# Altium project cybd18SV1.2.3F.PrjPcb
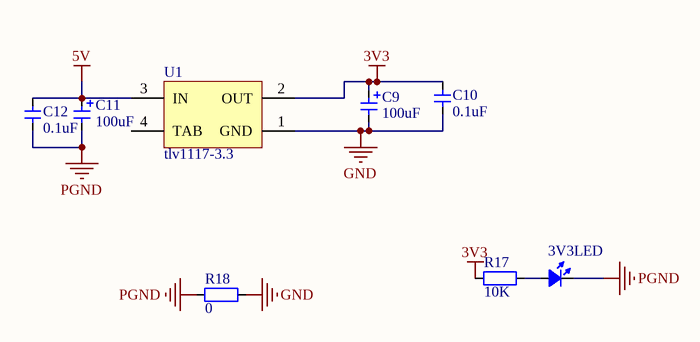
[diagram p0: tlv117_5_3.3.SchDoc]
9 sheets, 74 parts. Net scope: global (net labels, ports and power ports of the same name join across sheets).
Board file: cybd18SV1.2.3F.PcbDoc
Sheets:
  tlv117_5_3.3.SchDoc
  taj1050.SchDoc
  lm27313_5_12.SchDoc
  HIP4082driver.SchDoc
  tps5430_VIN_5V.SchDoc
  电流环.SchDoc
  74ls08.SchDoc
  F103H.SchDoc
  hcpl0630.SchDoc

## Sheet tlv117_5_3.3.SchDoc
size A4

### Parts
3V3LED  LED_0805  [LED_0805_BLUE]  (value not drawn)
C9  value 100uF  [CAP-TAN-6032/CAPC]  (hidden comment: Cap_Tan_0805)
C10  value 0.1uF  [CAP_0603]  (hidden comment: Cap_0603)
C11  value 100uF  [CAP-TAN-6032/CAPC]  (hidden comment: Cap_Tan_0805)
C12  value 0.1uF  [CAP_0603]  (hidden comment: Cap_0603)
R17  value 10K  [RES_0603]  (hidden comment: Res_0603)
R18  value 0  [RES_0603]  (hidden comment: Res_0603)
U1  tlv1117-3.3  [SOT223-3]

### Nets
3V3: C9.1 C10.2 R17.1 U1.2(OUT)
5V: C11.1 C12.2 U1.3(IN)
GND: C9.2 C10.1 R18.2 U1.1(GND)
PGND: 3V3LED.2(K) C11.2 C12.1 R18.1
Net3V3LED_1: 3V3LED.1(A) R17.2

Not connected (* = marked no-connect by the designer): U1 4(TAB)

### Library data of the parts
3V3LED = LED_0603: LED
C9 C11 = Cap_Tan_0805: Capacitor
C10 C12 = Cap_0603: Capacitor
R17 R18 = Res_0603: Resistor
U1 = LM1117IMP-5.0: 800mA Low-Dropout Linear Regulator; Manufacturer: National Semiconductor; CompType: LDO IC; PackageTopMarking: XYTT*N06B; PowerWise: N; Published: 4-Dec-2008; DatasheetVersion: Apr-2006; PackageVersion: revB, Apr-2003; PackageReference: MP04A; Publisher: Altium Limited; PackageDescription: Molded SOT-223, 6.50 x 3.56 x 1.6mm Body, 4 Lead, 2.3mm Pitch; PartNumber: LM1117IMP-5.0; RoHS: O; PinCount: 4; DigiKeyPartNumber: LM1117IMP-5.0CT-ND; Code_JEDEC: TO-261-AA; Code_IPC: SOT223-4; ComponentLink1Description: LM1117 Datasheet; ComponentLink1URL: http://www.national.com/ds/LM/LM1117.pdf; ComponentLink2Description: LM1117 Web Page; ComponentLink2URL: http://www.national.com/pf/LM/LM1117.html; ComponentLink3Description: MP04A Package Page; ComponentLink3URL: http://www.national.com/packaging/folders/mp04a.html

## Sheet taj1050.SchDoc
size A4
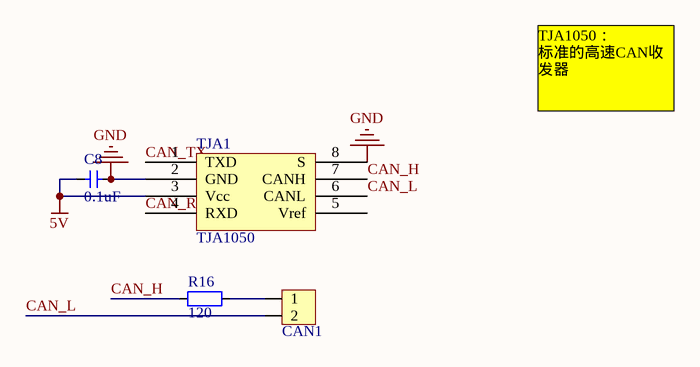
[diagram p1: taj1050.SchDoc]

### Parts
C8  value 0.1uF  [CAP_0603]  (hidden comment: Cap_0603)
CAN1  HDR1x2_2.54  [HDR1X2_2.54_180]  (value not drawn)
R16  value 120  [RES_0603]  (hidden comment: Res_0603)
TJA1  TJA1050  [SOP_E150_8]

### Nets
5V: C8.1 TJA1.3(Vcc)
GND: C8.2 TJA1.2(GND) TJA1.8(S)
CAN_H: R16.1 TJA1.7(CANH)
CAN_L: CAN1.2 TJA1.6(CANL)
CAN_RX: TJA1.4(RXD)
CAN_TX: TJA1.1(TXD)
NetCAN1_1: CAN1.1 R16.2

Not connected (* = marked no-connect by the designer): TJA1 5(Vref)

### Notes on the sheet
- TJA1050：
  标准的高速CAN收发器

### Library data of the parts
C8 = Cap_0603: Capacitor
CAN1 = HDR1x2_2.54: Header
R16 = Res_0603: Resistor
TJA1 = TJA1050: CAN总线收发器

## Sheet lm27313_5_12.SchDoc
size A4
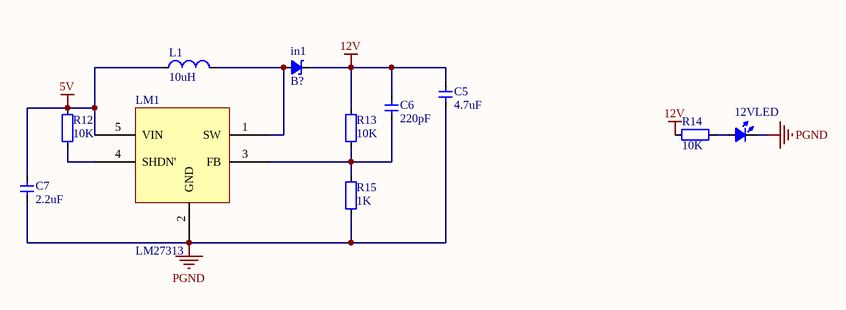
[diagram p2: lm27313_5_12.SchDoc]

### Parts
12VLED  LED_0805  [LED_0805_GREEN]  (value not drawn)
C5  value 4.7uF  [CAP_0603]  (hidden comment: Cap_0603)
C6  value 220pF  [CAP_0603]  (hidden comment: Cap_0603)
C7  value 2.2uF  [CAP_0603]  (hidden comment: Cap_0603)
in1  value B?  [SOD-123]  (hidden comment: SchottkyDiode_SOD123)
L1  value 10uH  [indmm5x2_2_2]
LM1  LM27313  [SOT23-5]
R12  value 10K  [RES_0603]  (hidden comment: Res_0603)
R13  value 10K  [RES_0603]  (hidden comment: Res_0603)
R14  value 10K  [RES_0603]  (hidden comment: Res_0603)
R15  value 1K  [RES_0603]  (hidden comment: Res_0603)

### Nets
5V: C7.2 L1.1 LM1.5(VIN) R12.2
12V: C5.2 C6.2 in1.2(K) R13.2 R14.1
PGND: 12VLED.2(K) C5.1 C7.1 LM1.2(GND) R15.1
Net12VLED_1: 12VLED.1(A) R14.2
NetC6_1: C6.1 LM1.3(FB) R13.1 R15.2
Netin1_1: in1.1(A) L1.2 LM1.1(SW)
NetLM1_4: LM1.4(SHDN') R12.1

### Library data of the parts
12VLED = LED_0603: LED
C5-C7 = Cap_0603: Capacitor
in1 = SchottkyDiode_SOD123: Diode
L1 = Ind_0603: Inductor
R12-R15 = Res_0603: Resistor

## Sheet HIP4082driver.SchDoc
size A4
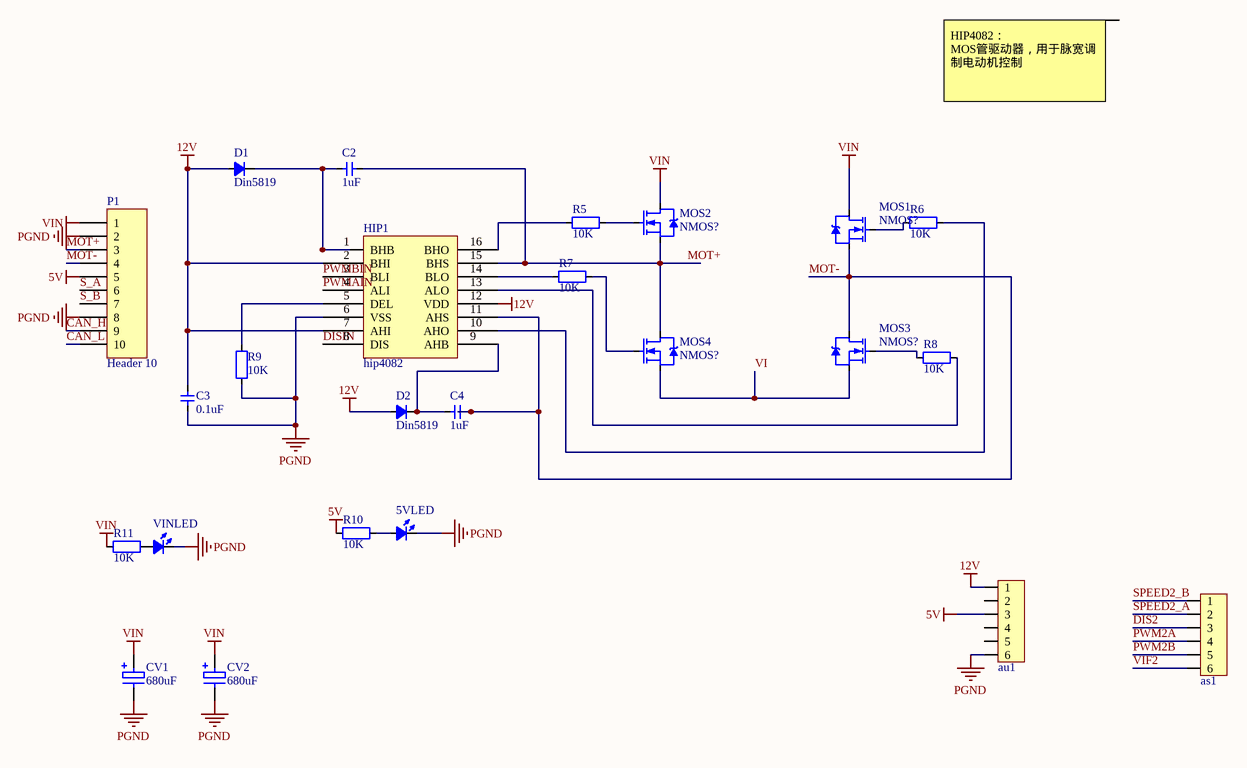
[diagram p3: HIP4082driver.SchDoc]

### Parts
5VLED  LED_0805  [LED_0805_BLUE]  (value not drawn)
as1  HDR1x6_2.54  [HDR1X6_2.54_180]  (value not drawn)
au1  HDR1x6_2.54  [HDR1X6_2.54_180]  (value not drawn)
C2  value 1uF  [CAP_0603]  (hidden comment: Cap_0603)
C3  value 0.1uF  [CAP_0603]  (hidden comment: Cap_0603)
C4  value 1uF  [CAP_0603]  (hidden comment: Cap_0603)
CV1  680uF  [CAP_ELE_680UF0.7X5MM]
CV2  680uF  [CAP_ELE_680UF0.7X5MM]
D1  Din5819  [SOD-323]
D2  Din5819  [SOD-323]
HIP1  hip4082  [SOP_E150_16]
MOS1  value NMOS?  [TO-252AA]  (hidden comment: MOSFET_N)
MOS2  value NMOS?  [TO-252AA]  (hidden comment: MOSFET_N)
MOS3  value NMOS?  [TO-252AA]  (hidden comment: MOSFET_N)
MOS4  value NMOS?  [TO-252AA]  (hidden comment: MOSFET_N)
P1  Header 10  [Green_10P]
R5  value 10K  [RES_0603]  (hidden comment: Res_0603)
R6  value 10K  [RES_0603]  (hidden comment: Res_0603)
R7  value 10K  [RES_0603]  (hidden comment: Res_0603)
R8  value 10K  [RES_0603]  (hidden comment: Res_0603)
R9  value 10K  [RES_0603]  (hidden comment: Res_0603)
R10  value 10K  [RES_0603]  (hidden comment: Res_0603)
R11  value 10K  [RES_0603]  (hidden comment: Res_0603)
VINLED  LED_0805  [LED_0805_RED]  (value not drawn)

### Nets
5V: au1.3 P1.5 R10.1
12V: au1.1 C3.2 D1.1(A) D2.1(A) HIP1.2(BHI) HIP1.7(AHI) HIP1.12(VDD)
PGND: 5VLED.2(K) au1.6 C3.1 CV1.2 CV2.2 HIP1.6(VSS) P1.2 P1.8 R9.1 VINLED.2(K)
VIN: CV1.1 CV2.1 MOS1.4(D) MOS2.4(D) P1.1 R11.1
CAN_H: P1.9
CAN_L: P1.10
DIS2: as1.3
DISIN: HIP1.8(DIS)
MOT+: C2.2 HIP1.15(BHS) MOS2.3(S) MOS4.4(D) P1.3
MOT-: C4.2 HIP1.11(AHS) MOS1.3(S) MOS3.4(D) P1.4
PWM2A: as1.4
PWM2B: as1.5
PWMAIN: HIP1.4(ALI)
PWMBIN: HIP1.3(BLI)
S_A: P1.6
S_B: P1.7
SPEED2_A: as1.2
SPEED2_B: as1.1
VI: MOS3.3(S) MOS4.3(S)
VIF2: as1.6
Net5VLED_1: 5VLED.1(A) R10.2
NetC2_1: C2.1 D1.2(K) HIP1.1(BHB)
NetC4_1: C4.1 D2.2(K) HIP1.9(AHB)
NetHIP1_5: HIP1.5(DEL) R9.2
NetHIP1_10: HIP1.10(AHO) R6.2
NetHIP1_13: HIP1.13(ALO) R8.2
NetHIP1_14: HIP1.14(BLO) R7.1
NetHIP1_16: HIP1.16(BHO) R5.1
NetMOS1_1: MOS1.1(G) R6.1
NetMOS2_1: MOS2.1(G) R5.2
NetMOS3_1: MOS3.1(G) R8.1
NetMOS4_1: MOS4.1(G) R7.2
NetR11_2: R11.2 VINLED.1(A)

Not connected (* = marked no-connect by the designer): au1 2 4 5

### Notes on the sheet
- HIP4082：
  MOS管驱动器，用于脉宽调制电动机控制

### Library data of the parts
5VLED VINLED = LED_0603: LED
as1 au1 = HDR1x6_2.54: Header
C2-C4 = Cap_0603: Capacitor
CV1 CV2 = CAP-ELE: 电解电容; Value: *μF; Published: 8-Jun-2000; LatestRevisionDate: 17-Jul-2002; LatestRevisionNote: Re-released for DXP Platform.; PackageReference: RB7.6-15; Publisher: Altium Limited; PackageDescription: Polarized Capacitor (Radial); 2 Leads
D1 D2 = Diode
MOS1-MOS4 = MOSFET_N: MOSFET
P1 = Header 10: Header, 10-Pin; LatestRevisionDate: 17-Jul-2002; LatestRevisionNote: Re-released for DXP Platform.; Publisher: Altium Limited
R5-R11 = Res_0603: Resistor

## Sheet tps5430_VIN_5V.SchDoc
size A4
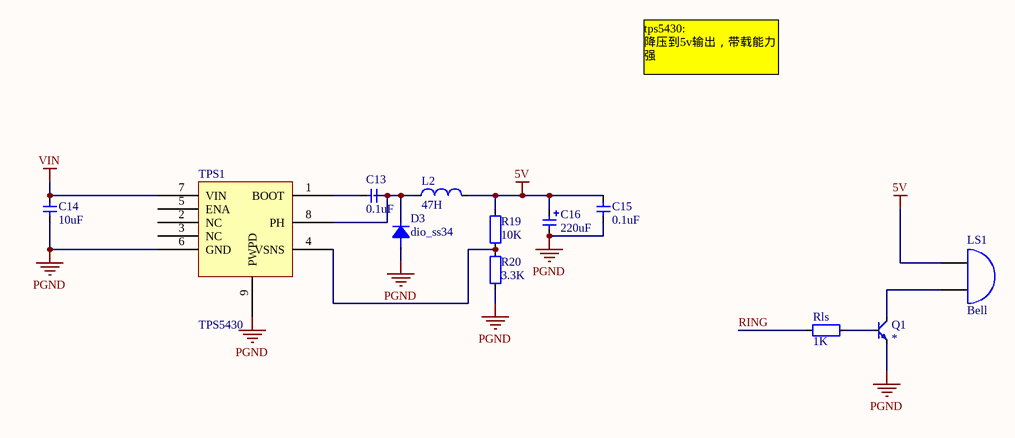
[diagram p4: tps5430_VIN_5V.SchDoc]

### Parts
(Parts that share a designator on the sheet are numbered #1, #2 ... from top to bottom, then left to right.)
C13  value 0.1uF  [CAP_0603]  (hidden comment: Cap_0603)
C14  value 10uF  [CAP_0603]  (hidden comment: Cap_0603)
C15  value 0.1uF  [CAP_0603]  (hidden comment: Cap_0603)
C16  value 220uF  [CAP-TAN-7343/CAPD]  (hidden comment: Cap_Tan_0805)
D3  dio_ss34  [dio_ss34]
L2  value 47H  [indmm5x1.2x4x5]  (hidden comment: Ind_0603)
LS1#1  Bell  [Bell-5.6-0.6-9mm]
Q1  BJT_NPN  [SOT23-3]  (value not drawn)
R19  value 10K  [RES_0603]  (hidden comment: Res_0603)
R20  value 3.3K  [RES_0603]  (hidden comment: Res_0603)
Rls  value 1K  [RES_0603]  (hidden comment: Res_0603)
TPS1  TPS5430  [SOP_E150_9]

### Nets
5V: C15.2 C16.1 L2.2 LS1#1.1(A) R19.2
PGND: C14.1 C15.1 C16.2 D3.1 Q1.2(E) R20.1 TPS1.6(GND) TPS1.9(PWPD)
VIN: C14.2 TPS1.7(VIN)
RING: Rls.1
NetC13_1: C13.1 TPS1.1(BOOT)
NetC13_2: C13.2 D3.2 L2.1 TPS1.8(PH)
NetLS1#1_2: LS1#1.2(B) Q1.3(C)
NetQ1_1: Q1.1(B) Rls.2
NetR19_1: R19.1 R20.2 TPS1.4(VSNS)

Not connected (* = marked no-connect by the designer): TPS1 2(NC) 3(NC) 5(ENA)

### Notes on the sheet
- tps5430:
  降压到5v输出，带载能力强

### Library data of the parts
C13-C15 = Cap_0603: Capacitor
C16 = Cap_Tan_0805: Capacitor
L2 = Ind_0603: Inductor
LS1#1 = Bell: Electrical Bell; Published: 24-Mar-1999; LatestRevisionDate: 17-Jul-2002; LatestRevisionNote: Re-released for DXP Platform.; PackageReference: PIN2; Publisher: Altium Limited
Q1 = BJT_NPN: Transistor; Value: *
R19 R20 Rls = Res_0603: Resistor

## Sheet 电流环.SchDoc
size A4
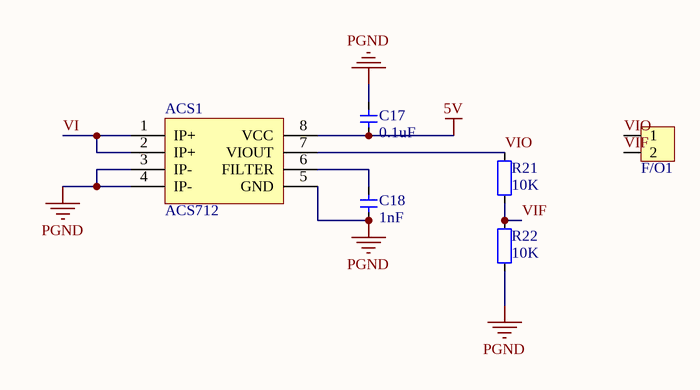
[diagram p5: 电流环.SchDoc]

### Parts
ACS1  ACS712  [SOP8ACS712]
C17  value 0.1uF  [CAP_0603]  (hidden comment: Cap_0603)
C18  value 1nF  [CAP_0603]  (hidden comment: Cap_0603)
F/O1  HDR1x2_2.54  [HDR1X2_2.54_180]  (value not drawn)
R21  value 10K  [RES_0603]  (hidden comment: Res_0603)
R22  value 10K  [RES_0603]  (hidden comment: Res_0603)

### Nets
5V: ACS1.8(VCC) C17.1
PGND: ACS1.3(IP-) ACS1.4(IP-) ACS1.5(GND) C17.2 C18.1 R22.2
VI: ACS1.1(IP+) ACS1.2(IP+)
VIF: F/O1.2 R21.2 R22.1
VIO: ACS1.7(VIOUT) F/O1.1 R21.1
NetACS1_6: ACS1.6(FILTER) C18.2

### Library data of the parts
ACS1 = ACS712: Sensor Current
C17 C18 = Cap_0603: Capacitor
F/O1 = HDR1x2_2.54: Header
R21 R22 = Res_0603: Resistor

## Sheet 74ls08.SchDoc
size A4
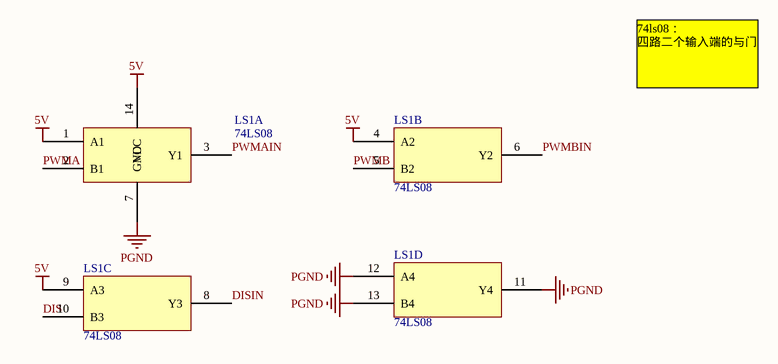
[diagram p6: 74ls08.SchDoc]

### Parts
(Parts that share a designator on the sheet are numbered #1, #2 ... from top to bottom, then left to right.)
LS1#2  74LS08  [SOP14]  (parts A,B,C,D of 4)

### Nets
5V: LS1#2.1(A1) LS1#2.4(A2) LS1#2.9(A3) LS1#2.14(VCC)
PGND: LS1#2.7(GND) LS1#2.11(Y4) LS1#2.12(A4) LS1#2.13(B4)
DIS: LS1#2.10(B3)
DISIN: LS1#2.8(Y3)
PWMA: LS1#2.2(B1)
PWMAIN: LS1#2.3(Y1)
PWMB: LS1#2.5(B2)
PWMBIN: LS1#2.6(Y2)

### Notes on the sheet
- 74ls08：
  四路二个输入端的与门

## Sheet F103H.SchDoc
size A4
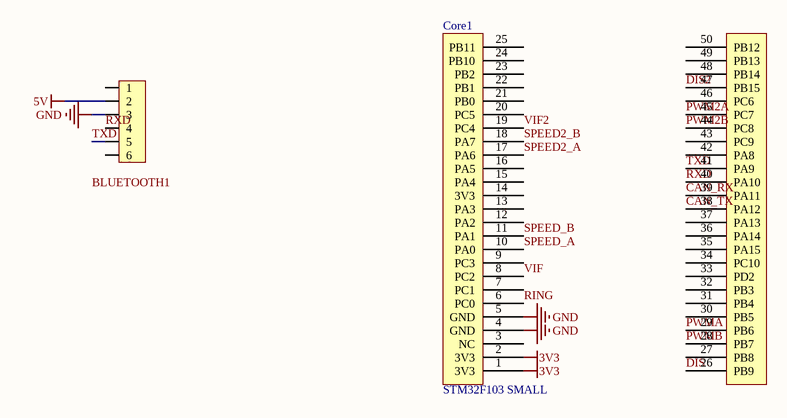
[diagram p7: F103H.SchDoc]

### Parts
BLUETOOTH1  HDR1x6_2.54  [HDR1X6_2.54_180]  (value not drawn)
Core1  STM32F103 SMALL  [STM32F103Small]

### Nets
3V3: Core1.1(3V3) Core1.2(3V3)
5V: BLUETOOTH1.2
GND: BLUETOOTH1.3 Core1.4(GND) Core1.5(GND)
CAN_RX: Core1.39(PA11)
CAN_TX: Core1.38(PA12)
DIS: Core1.26(PB9)
DIS2: Core1.47(PB15)
PWM2A: Core1.45(PC7)
PWM2B: Core1.44(PC8)
PWMA: Core1.29(PB6)
PWMB: Core1.28(PB7)
RING: Core1.6(PC0)
RXD: BLUETOOTH1.4 Core1.40(PA10)
SPEED2_A: Core1.17(PA6)
SPEED2_B: Core1.18(PA7)
SPEED_A: Core1.10(PA0)
SPEED_B: Core1.11(PA1)
TXD: BLUETOOTH1.5 Core1.41(PA9)
VIF: Core1.8(PC2)
VIF2: Core1.19(PC4)

Not connected (* = marked no-connect by the designer): BLUETOOTH1 1 6; Core1 3(NC) 7(PC1) 9(PC3) 12(PA2) 13(PA3) 14(3V3) 15(PA4) 16(PA5) 20(PC5) 21(PB0) 22(PB1) 23(PB2) 24(PB10) 25(PB11) 27(PB8) 30(PB5) 31(PB4) 32(PB3) 33(PD2) 34(PC10) 35(PA15) 36(PA14) 37(PA13) 42(PA8) 43(PC9) 46(PC6) 48(PB14) 49(PB13) 50(PB12)

### Library data of the parts
BLUETOOTH1 = HDR1x6_2.54: Header

## Sheet hcpl0630.SchDoc
size A4
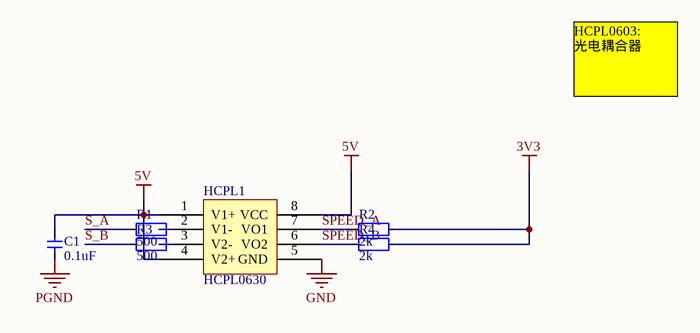
[diagram p8: hcpl0630.SchDoc]

### Parts
C1  value 0.1uF  [CAP_0603]  (hidden comment: Cap_0603)
HCPL1  HCPL0630  [SOP_E150_8]
R1  value 500  [RES_0603]  (hidden comment: Res_0603)
R2  value 2k  [RES_0603]  (hidden comment: Res_0603)
R3  value 500  [RES_0603]  (hidden comment: Res_0603)
R4  value 2k  [RES_0603]  (hidden comment: Res_0603)

### Nets
3V3: R2.1 R4.1
5V: C1.2 HCPL1.1(V1+) HCPL1.4(V2+) HCPL1.8(VCC)
GND: HCPL1.5(GND)
PGND: C1.1
S_A: R1.2
S_B: R3.2
SPEED_A: HCPL1.7(VO1) R2.2
SPEED_B: HCPL1.6(VO2) R4.2
NetHCPL1_2: HCPL1.2(V1-) R1.1
NetHCPL1_3: HCPL1.3(V2-) R3.1

### Notes on the sheet
- HCPL0603:
  光电耦合器

### Library data of the parts
C1 = Cap_0603: Capacitor
R1-R4 = Res_0603: Resistor

## Nets that join several sheets
3V3: tlv117_5_3.3 (C9.1 C10.2 R17.1 U1.2), F103H (Core1.1 Core1.2), hcpl0630 (R2.1 R4.1)
5V: tlv117_5_3.3 (C11.1 C12.2 U1.3), taj1050 (C8.1 TJA1.3), lm27313_5_12 (C7.2 L1.1 LM1.5 R12.2), HIP4082driver (au1.3 P1.5 R10.1), tps5430_VIN_5V (5 pins), 电流环 (ACS1.8 C17.1), 74ls08 (LS1#2.1 LS1#2.4 LS1#2.9 LS1#2.14), F103H (BLUETOOTH1.2), hcpl0630 (C1.2 HCPL1.1 HCPL1.4 HCPL1.8)
12V: lm27313_5_12 (5 pins), HIP4082driver (7 pins)
GND: tlv117_5_3.3 (C9.2 C10.1 R18.2 U1.1), taj1050 (C8.2 TJA1.2 TJA1.8), F103H (BLUETOOTH1.3 Core1.4 Core1.5), hcpl0630 (HCPL1.5)
PGND: tlv117_5_3.3 (3V3LED.2 C11.2 C12.1 R18.1), lm27313_5_12 (5 pins), HIP4082driver (10 pins), tps5430_VIN_5V (8 pins), 电流环 (6 pins), 74ls08 (LS1#2.7 LS1#2.11 LS1#2.12 LS1#2.13), hcpl0630 (C1.1)
VIN: HIP4082driver (6 pins), tps5430_VIN_5V (C14.2 TPS1.7)
CAN_H: taj1050 (R16.1 TJA1.7), HIP4082driver (P1.9)
CAN_L: taj1050 (CAN1.2 TJA1.6), HIP4082driver (P1.10)
CAN_RX: taj1050 (TJA1.4), F103H (Core1.39)
CAN_TX: taj1050 (TJA1.1), F103H (Core1.38)
DIS: 74ls08 (LS1#2.10), F103H (Core1.26)
DIS2: HIP4082driver (as1.3), F103H (Core1.47)
DISIN: HIP4082driver (HIP1.8), 74ls08 (LS1#2.8)
PWM2A: HIP4082driver (as1.4), F103H (Core1.45)
PWM2B: HIP4082driver (as1.5), F103H (Core1.44)
PWMA: 74ls08 (LS1#2.2), F103H (Core1.29)
PWMAIN: HIP4082driver (HIP1.4), 74ls08 (LS1#2.3)
PWMB: 74ls08 (LS1#2.5), F103H (Core1.28)
PWMBIN: HIP4082driver (HIP1.3), 74ls08 (LS1#2.6)
RING: tps5430_VIN_5V (Rls.1), F103H (Core1.6)
S_A: HIP4082driver (P1.6), hcpl0630 (R1.2)
S_B: HIP4082driver (P1.7), hcpl0630 (R3.2)
SPEED2_A: HIP4082driver (as1.2), F103H (Core1.17)
SPEED2_B: HIP4082driver (as1.1), F103H (Core1.18)
SPEED_A: F103H (Core1.10), hcpl0630 (HCPL1.7 R2.2)
SPEED_B: F103H (Core1.11), hcpl0630 (HCPL1.6 R4.2)
VI: HIP4082driver (MOS3.3 MOS4.3), 电流环 (ACS1.1 ACS1.2)
VIF: 电流环 (F/O1.2 R21.2 R22.1), F103H (Core1.8)
VIF2: HIP4082driver (as1.6), F103H (Core1.19)